# Altium schematic sheet Nucleo.SchDoc
size A4; Organization: BME AUT; Address1: Magyar tudósok krt. 2.; Address2: Q épület; Address3: Budapest; Address4: H-1117; DocumentNumber: 1; SheetNumber: 1; SheetTotal: 2
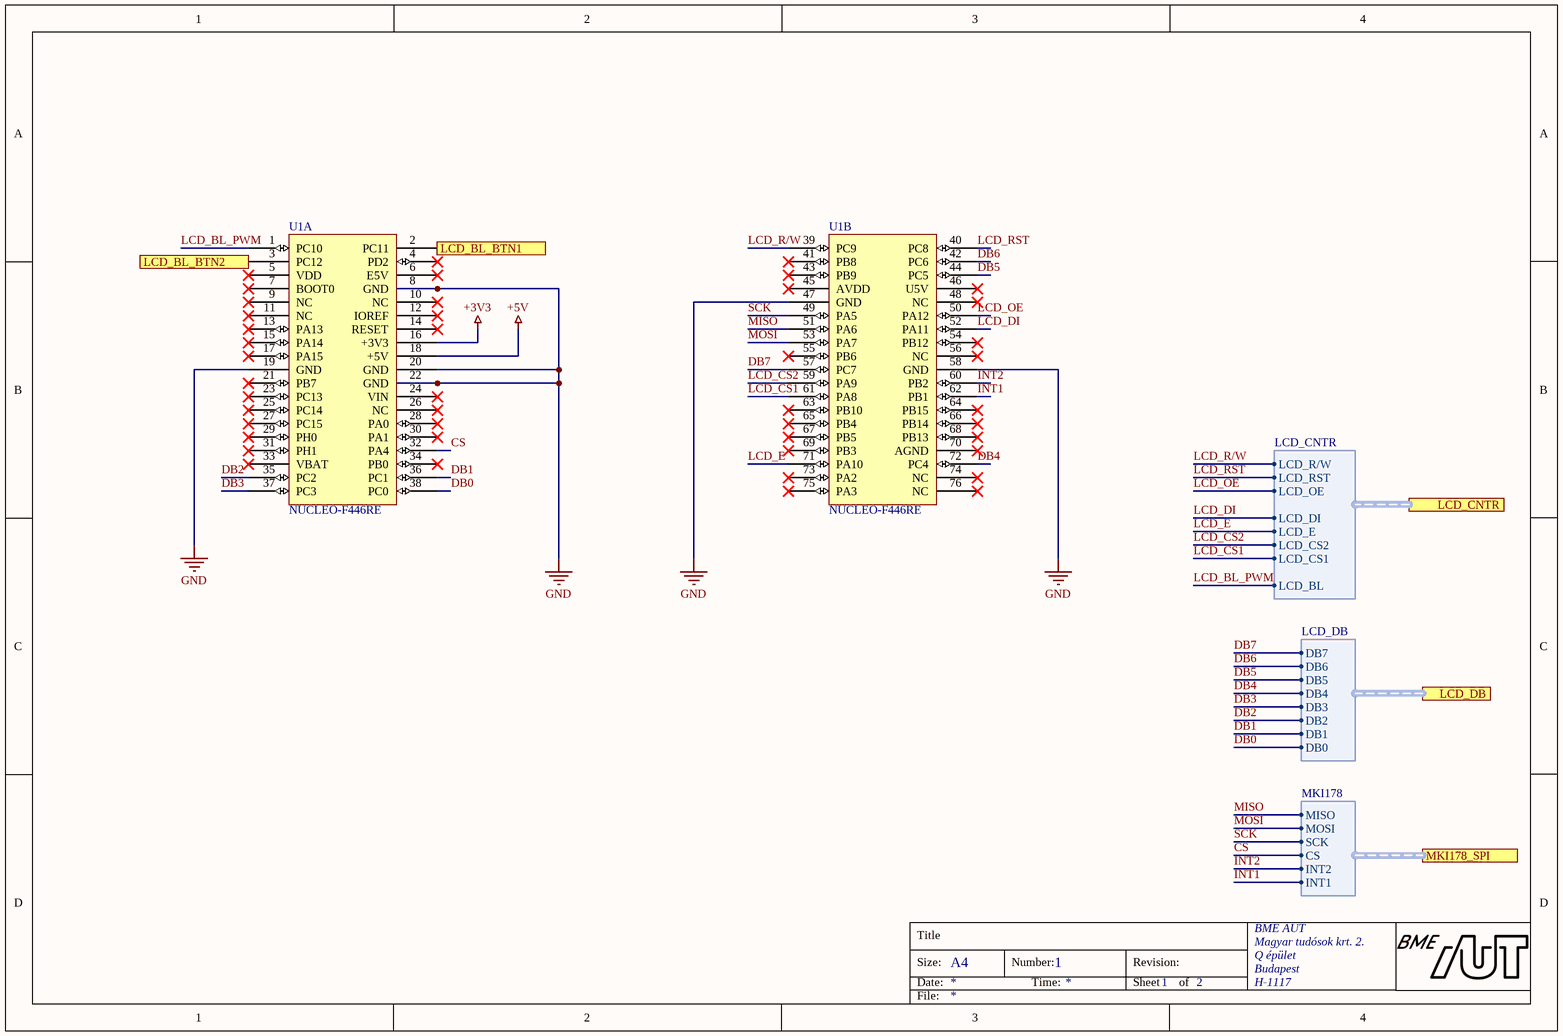
[diagram p0: Nucleo.SchDoc]

## Parts
U1  NUCLEO-F446RE  [FP_NUCLEO-64]  (parts A,B of 2)

## Ports
LCD_BL_BTN1, LCD_BL_BTN2, LCD_CNTR (harness LCD_CNTR), LCD_DB (harness LCD_DB), MKI178_SPI (harness MKI178)

## Harnesses
MKI178: MISO, MOSI, SCK, CS, INT2, INT1
LCD_DB: DB0, DB1, DB2, DB3, DB4, DB5, DB6, DB7
LCD_CNTR: LCD_CS1, LCD_CS2, LCD_E, LCD_DI, LCD_RST, LCD_R/W, LCD_OE, LCD_BL

## Nets
+3V3: U1.16(+3V3)
+5V: U1.18(+5V)
GND: U1.8(GND) U1.19(GND) U1.20(GND) U1.22(GND) U1.47(GND) U1.58(GND)
CS: U1.32(PA4) ; port MKI178_SPI.CS
DB0: U1.38(PC0) ; port LCD_DB.DB0
DB1: U1.36(PC1) ; port LCD_DB.DB1
DB2: U1.35(PC2) ; port LCD_DB.DB2
DB3: U1.37(PC3) ; port LCD_DB.DB3
DB4: U1.72(PC4) ; port LCD_DB.DB4
DB5: U1.44(PC5) ; port LCD_DB.DB5
DB6: U1.42(PC6) ; port LCD_DB.DB6
DB7: U1.57(PC7) ; port LCD_DB.DB7
INT1: U1.62(PB1) ; port MKI178_SPI.INT1
INT2: U1.60(PB2) ; port MKI178_SPI.INT2
LCD_BL_BTN1: U1.2(PC11) ; port LCD_BL_BTN1
LCD_BL_BTN2: U1.3(PC12) ; port LCD_BL_BTN2
LCD_BL_PWM: U1.1(PC10) ; port LCD_CNTR.LCD_BL
LCD_CS1: U1.61(PA8) ; port LCD_CNTR.LCD_CS1
LCD_CS2: U1.59(PA9) ; port LCD_CNTR.LCD_CS2
LCD_DI: U1.52(PA11) ; port LCD_CNTR.LCD_DI
LCD_E: U1.71(PA10) ; port LCD_CNTR.LCD_E
LCD_OE: U1.50(PA12) ; port LCD_CNTR.LCD_OE
LCD_R/W: U1.39(PC9) ; port LCD_CNTR.LCD_R/W
LCD_RST: U1.40(PC8) ; port LCD_CNTR.LCD_RST
MISO: U1.51(PA6) ; port MKI178_SPI.MISO
MOSI: U1.53(PA7) ; port MKI178_SPI.MOSI
SCK: U1.49(PA5) ; port MKI178_SPI.SCK

Not connected (* = marked no-connect by the designer): U1 4(PD2)* 5(VDD)* 6(E5V)* 7(BOOT0)* 9(NC)* 10(NC)* 11(NC)* 12(IOREF)* 13(PA13)* 14(RESET)* 15(PA14)* 17(PA15)* 21(PB7)* 23(PC13)* 24(VIN)* 25(PC14)* 26(NC)* 27(PC15)* 28(PA0)* 29(PH0)* 30(PA1)* 31(PH1)* 33(VBAT)* 34(PB0)* 41(PB8)* 43(PB9)* 45(AVDD)* 46(U5V)* 48(NC)* 54(PB12)* 55(PB6)* 56(NC)* 63(PB10)* 64(PB15)* 65(PB4)* 66(PB14)* 67(PB5)* 68(PB13)* 69(PB3)* 70(AGND)* 73(PA2)* 74(NC)* 75(PA3)* 76(NC)*

## Notes on the sheet
- Title
- Size:
- Date:
- A4
- Number:
- Time:
- Revision:
- Sheet
- of
- File:

## Library data of the parts
U1 = NUCLEO-F446RE: Reference: NUCLEO; Name: Nucleo F446RE; Supplier: Tanszék